# EAGLE design PidiPad (EAGLE 9.2.0)
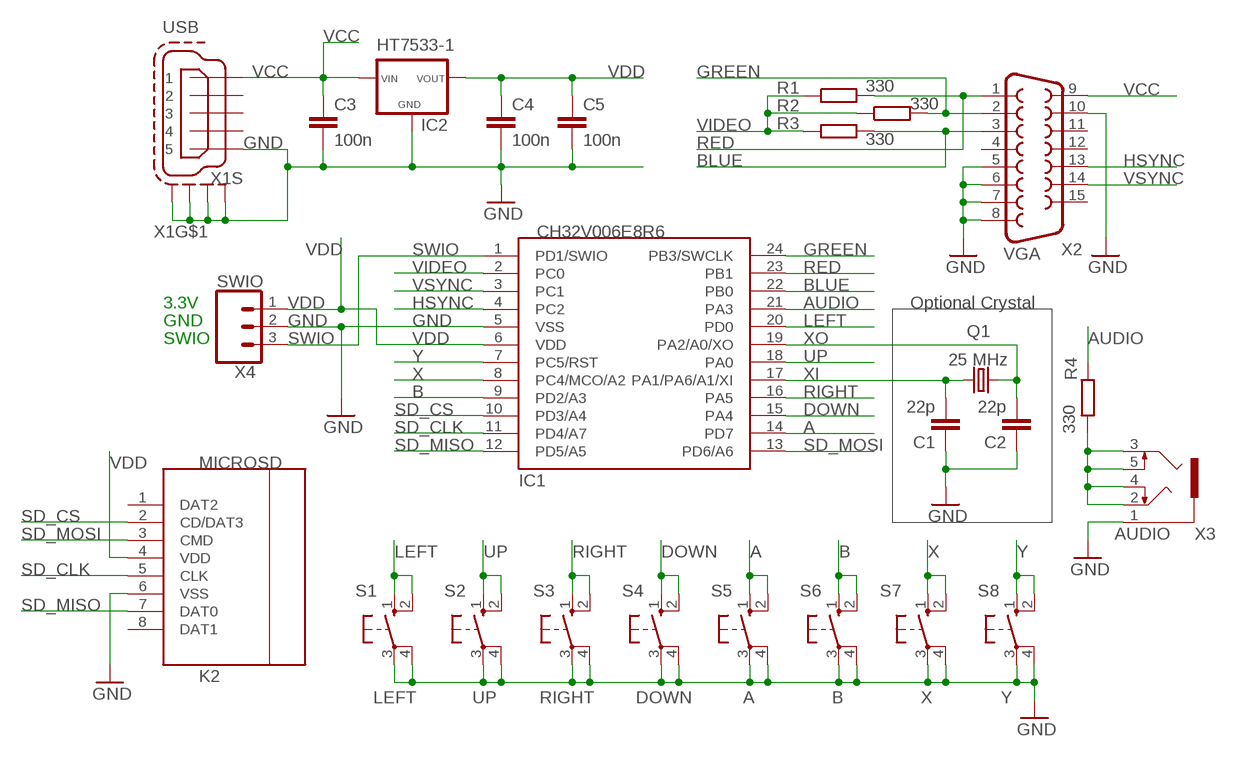
[diagram p0: schematic, sheet 1]

## Parts
C1  22p  C-EU050-024X044  [C050-024X044]
C2  22p  C-EU050-024X044  [C050-024X044]
C3  100n  C-EU050-024X044  [C050-024X044]
C4  100n  C-EU050-024X044  [C050-024X044]
C5  100n  C-EU050-024X044  [C050-024X044]
IC1  CH32V006E8R6  [QSOP24]
IC2  HT7533-1  [HT7533-1]
K2  MICROSD  [MICROSD]
Q1  25 MHz  CRYSTALHC49U-V  [HC49U-V]
R1  330  R-EU_0204/7  [0204/7]
R2  330  R-EU_0204/7  [0204/7]
R3  330  R-EU_0204/7  [0204/7]
R4  330  R-EU_0204/7  [0204/7]
S1  LEFT  10-XX  [B3F-10XX]
S2  UP  10-XX  [B3F-10XX]
S3  RIGHT  10-XX  [B3F-10XX]
S4  DOWN  10-XX  [B3F-10XX]
S5  A  10-XX  [B3F-10XX]
S6  B  10-XX  [B3F-10XX]
S7  X  10-XX  [B3F-10XX]
S8  Y  10-XX  [B3F-10XX]
X1  USB  MINI-USB-SCHIELD-32005-201  [32005-201]
X2  VGA  F15HDH  [HDF15H]
X3  AUDIO  1503_09  [1503_09]
X4  SWIO  CONN_03  [1X03]

## Nets
A: IC1.14(PD7) S5.1(S) S5.2(S1)
AUDIO: IC1.21(PA3) R4.2
B: IC1.9(PD2/A3) S6.1(S) S6.2(S1)
BLUE: IC1.22(PB0) R3.2 X2.3
DOWN: IC1.15(PA4) S4.1(S) S4.2(S1)
GND: C1.1 C2.1 C3.2 C4.2 C5.2 IC1.5(VSS) IC2.GND K2.6(VSS) S1.3(P) S1.4(P1) S2.3(P) S2.4(P1) S3.3(P) S3.4(P1) S4.3(P) S4.4(P1) S5.3(P) S5.4(P1) S6.3(P) S6.4(P1) S7.3(P) S7.4(P1) S8.3(P) S8.4(P1) X1.5 X1.M1(S:S1) X1.M2(S:S2) X1.M3(S:S3) X1.M4(S:S4) X2.5 X2.6 X2.7 X2.8 X2.10 X3.1 X4.2
GREEN: IC1.24(PB3/SWCLK) R2.2 X2.2
HSYNC: IC1.4(PC2) X2.13
LEFT: IC1.20(PD0) S1.1(S) S1.2(S1)
N$7: R4.1 X3.2 X3.3 X3.4 X3.5
RED: IC1.23(PB1) R1.2 X2.1
RIGHT: IC1.16(PA5) S3.1(S) S3.2(S1)
SD_CLK: IC1.11(PD4/A7) K2.5(CLK)
SD_CS: IC1.10(PD3/A4) K2.2(CD/DAT3)
SD_MISO: IC1.12(PD5/A5) K2.7(DAT0)
SD_MOSI: IC1.13(PD6/A6) K2.3(CMD)
SWIO: IC1.1(PD1/SWIO) X4.3
UP: IC1.18(PA0) S2.1(S) S2.2(S1)
VCC: C3.1 IC2.VIN X1.1 X2.9
VDD: C4.1 C5.1 IC1.6(VDD) IC2.VOUT K2.4(VDD) X4.1
VIDEO: IC1.2(PC0) R1.1 R2.1 R3.1
VSYNC: IC1.3(PC1) X2.14
X: IC1.8(PC4/MCO/A2) S7.1(S) S7.2(S1)
XI: C1.2 IC1.17(PA1/PA6/A1/XI) Q1.2
XO: C2.2 IC1.19(PA2/A0/XO) Q1.1
Y: IC1.7(PC5/RST) S8.1(S) S8.2(S1)
Unconnected: K2.1(DAT2) K2.8(DAT1) X1.2 X1.3 X1.4 X2.4 X2.11 X2.12 X2.15

## Notes on the sheet
- 3.3V | Optional Crystal
- GND
- SWIO

## Library data of the parts
C1-C5 = rcl:C-EU: CAPACITOR, European symbol; SPICEPREFIX: C
IC1 = CH32V:CH32V006E8R6
IC2 = HT7533-1B:HT7533-1
K2 = Wuerth_Elektronik_eiCan_Communication_Connectors_v2.2:MICROSD: WR-CRD MICRO SD CARD CONNECTOR HINGE 8PINS
Q1 = crystal:CRYSTAL: CRYSTAL; OC_FARNELL: 1666969; OC_NEWARK: unknown
R1-R4 = rcl:R-EU_: RESISTOR, European symbol; SPICEPREFIX: R
S1-S8 = switch-omron:10-XX: OMRON SWITCH; MPN: B3F-1000; OC_FARNELL: 176432; OC_NEWARK: 36M3542
X1 = con-cypressindustries:MINI-USB-SCHIELD-: MINI USB-B Conector Source: www.cypressindustries.com; OC_FARNELL: unknown; OC_NEWARK: unknown
X2 = adafruit_B:F15: SUB-D HDH is also known as a 'right angle VGA' connector
X3 = con-lumberg:1503_09: Jack connectors according to JISC 6560, 3.5 mm Klinkeneinbaukupplung nach JISC 6560, 3,5 mm, 3-polig/ stereo, abgewinkelte Ausführung, mit 2 Öffnern und Lötaugen, für Leiterplatten Rückseitenmontage Source: http://www.lumberg.com/Produkte/PDFs/1503_09.pdf; OC_FARNELL: 1243244; OC_NEWARK: unknown
X4 = SparkFun-Connectors:CONN_03: Multi connection point. Often used as Generic Header-pin footprint for 0.1 inch spaced/style header connections On any of the 0.1 inch spaced packages, you can populate with these: Break Away Headers - Straight <https://www.sparkfun.com/products/116> (PRT-00116) Break Away Male Headers - Right Angle <https://www.sparkfun.com/products/553> (PRT-00553) Female Headers <https://www.sparkfun.com/products/115> (PRT-00115) Break Away Headers - Machine Pin <https://www.sparkfun.com/products/117> (PRT-00117) Break Away Female Headers - Swiss Machine Pin <https://www.sparkfun.com/products/743> (PRT-00743) Stackable Header - 3 Pin (Female, 0.1") <https://www.sparkfun.com/products/13875> (PRT-13875) For SCREWTERMINALS and SPRING TERMINALS visit here: Screw Terimnals on SparkFun.com <https://www.sparkfun.com/search/results?term=Screw+Terminals> (5mm/3.5mm/2.54mm spacing) This device is also useful as a general connection point to wire up your design to another part of your project. Our various solder wires solder well into these plated through hole pads. Hook-Up Wire - Assortment (Stranded, 22 AWG) <https://www.sparkfun.com/products/11375> (PRT-11375) Hook-Up Wire - Assortment (Solid Core, 22 AWG) <https://www.sparkfun.com/products/11367> (PRT-11367) View the entire wire category on our website here <https://www.sparkfun.com/categories/141> Special notes: Molex polarized connector foot print use with SKU : PRT-08232 with associated crimp pins and housings.

## Board
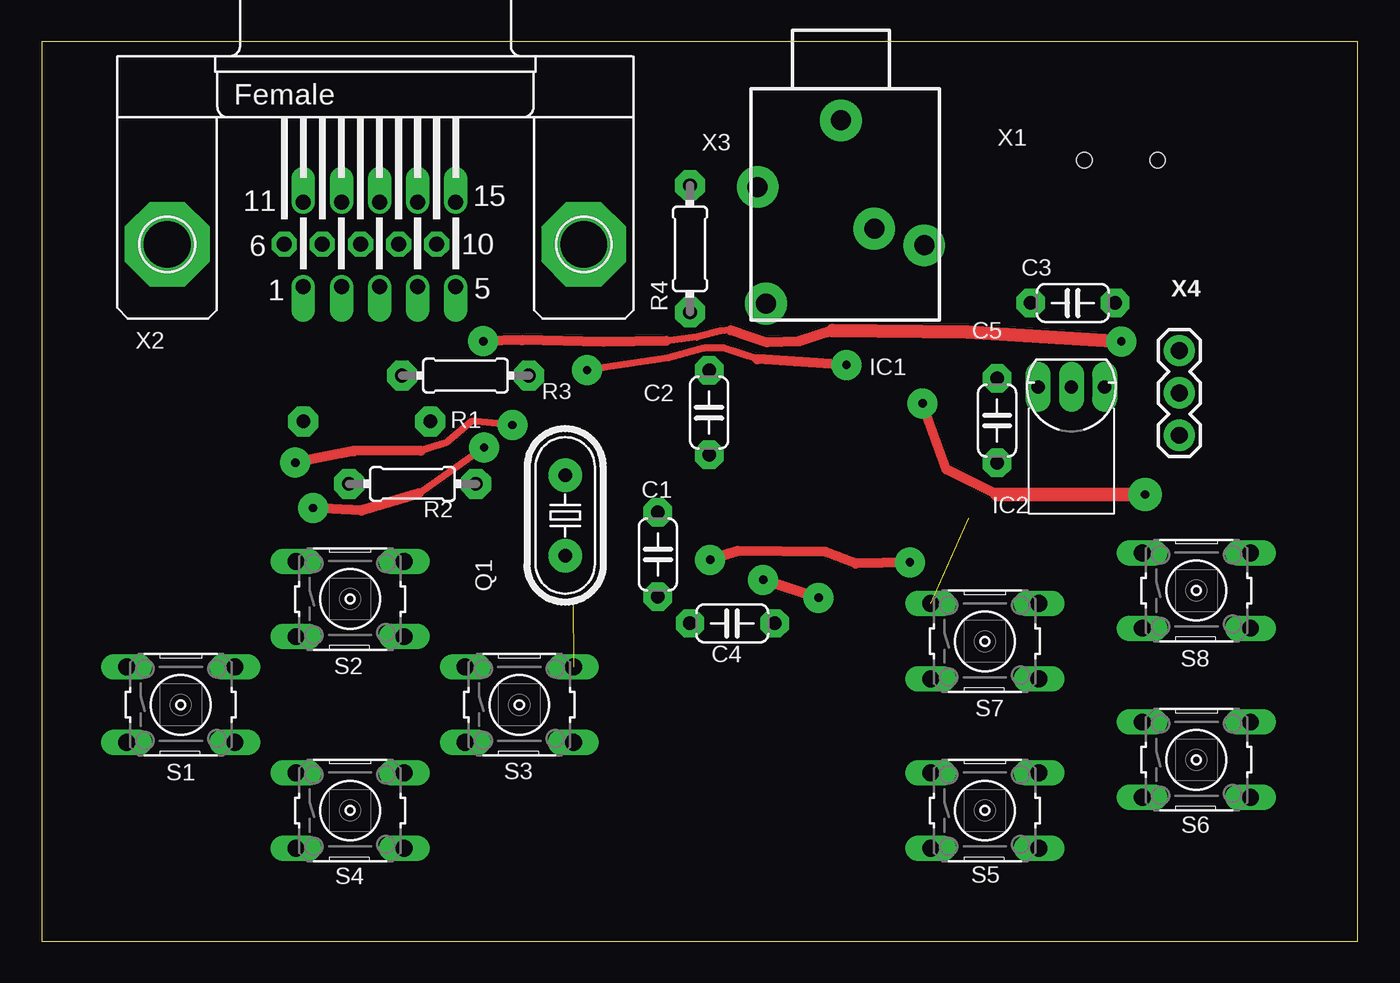
[diagram p1: board, top side]
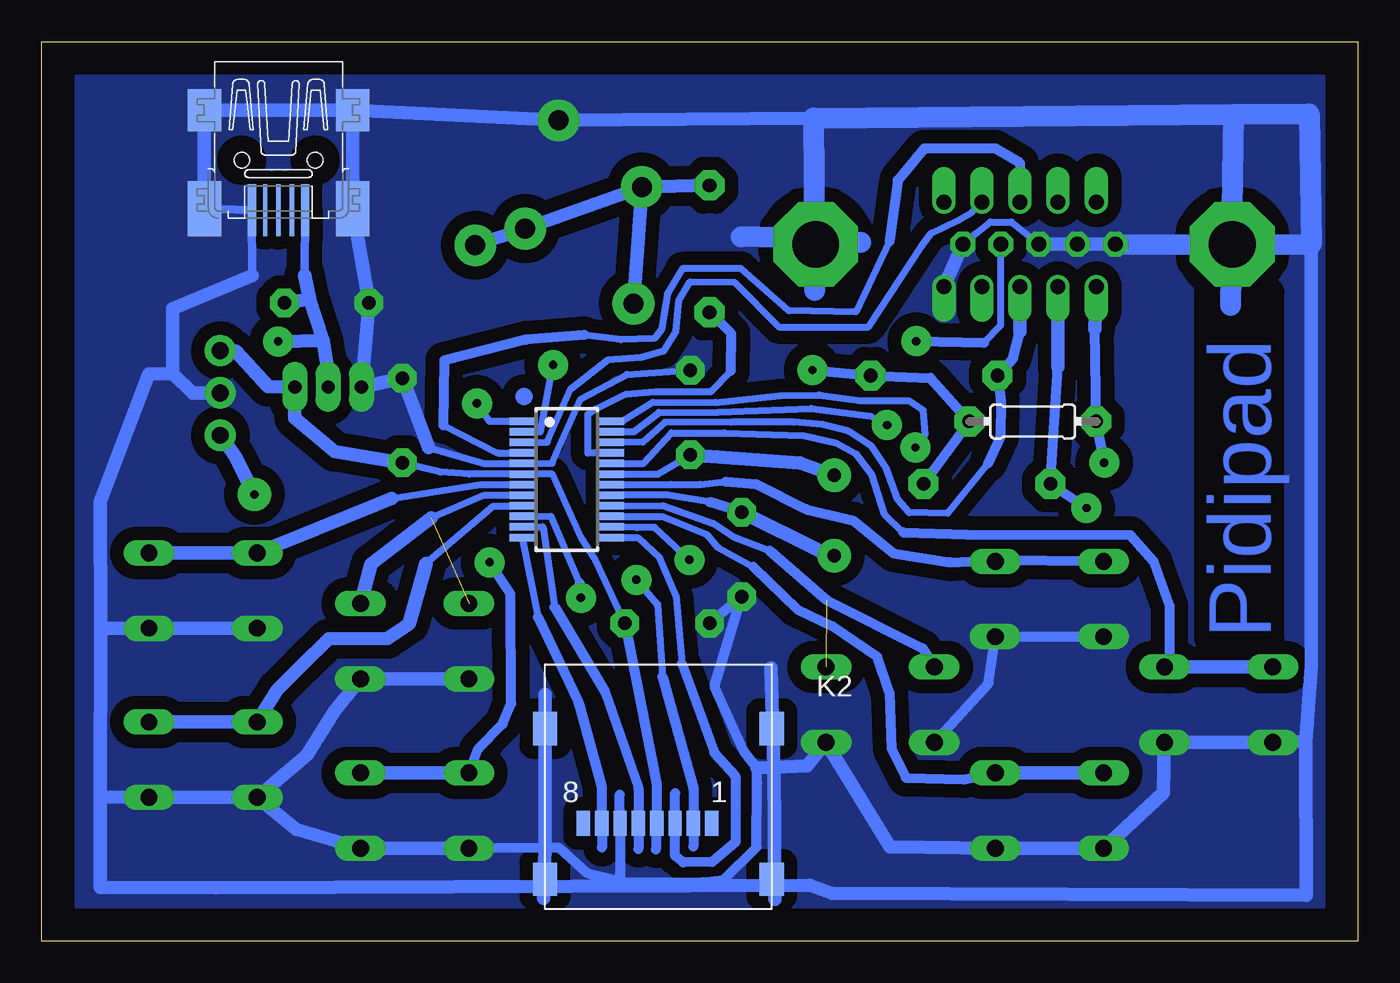
[diagram p2: board, bottom side, seen from below]

Size 79 x 54 mm. Coordinates in mm from the lower left corner, seen from the top.
Outline: 0,0 79,0 79,54 0,54 0,0
Copper layers (1*16): Top 0.035mm / dielectric 1.5mm / Bottom 0.035mm
Design rules "default": minimum track width 6mil, minimum drill 0.35mm, track to track 6mil, track to pad 6mil, pad to pad 6mil, via to via 6mil, smd to smd 6mil, copper to edge 40mil, drill to drill 6mil, minimum pad ring 10mil, minimum via ring 8mil, stop-mask expansion 4mil, vias tented up to drill 0mil, thermal gap 10mil

### Footprints (pad centres in the part's own frame; a part is rotated, then mirrored left to right if it is on the bottom)
C050-024X044 = drill 0.813 pad 1.7 octagon: 1 -2.54,0; 2 2.54,0
QSOP24 = smd 0.45 x 1.5: 1 -3.493,-2.69; 2 -2.857,-2.69; 3 -2.223,-2.69; 4 -1.587,-2.69; 5 -0.953,-2.69; 6 -0.318,-2.69; 7 0.318,-2.69; 8 0.953,-2.69; 9 1.587,-2.69; 10 2.223,-2.69; 11 2.857,-2.69; 12 3.493,-2.69; 13 3.493,2.69; 14 2.857,2.69; 15 2.223,2.69; 16 1.587,2.69; 17 0.953,2.69; 18 0.318,2.69; 19 -0.318,2.69; 20 -0.953,2.69; 21 -1.587,2.69; 22 -2.223,2.69; 23 -2.857,2.69; 24 -3.493,2.69
HT7533-1 = drill 0.8 pad 1.5 long: GND 2,0; VIN 0,0; VOUT -2,0
MICROSD = smd 0.8 x 1.5: 1 2.62,-2.54; 2 1.52,-2.54; 3 0.42,-2.54; 4 -0.68,-2.54; 5 -1.78,-2.54; 6 -2.88,-2.54; 7 -3.98,-2.54; 8 -5.08,-2.54 | smd 1.45 x 2: Z1 -7.38,3.16; Z2 6.22,3.16; Z3 -7.38,-5.89; Z4 6.22,-5.89
HC49U-V = drill 0.813 pad 2: 1 -2.413,0; 2 2.413,0
0204/7 = drill 0.813 pad 1.8 octagon: 1 -3.81,0; 2 3.81,0
B3F-10XX = drill 1.016 long: 1 -3.251,2.261; 2 3.251,2.261; 3 -3.251,-2.261; 4 3.251,-2.261
32005-201 = smd 3.1 x 0.5: 1 3,1.6; 5 3,-1.6 | smd 3.1 x 0.254: 2 3,0.8; 3 3,0; 4 3,-0.8 | smd 2.5 x 2: M1 -3,-4.45; M2 -3,4.45 | smd 3.3 x 2: M3 2.9,4.45; M4 2.9,-4.45 | hole 0.9: 0,2.2; 0,-2.2
HDF15H = drill 0.9 pad 1.27 offset: 1 4.329,2.54; 2 2.043,2.54; 3 -0.243,2.54; 4 -2.529,2.54; 5 -4.815,2.54; 11 4.329,-2.54; 12 2.043,-2.54; 13 -0.243,-2.54; 14 -2.529,-2.54; 15 -4.815,-2.54 | drill 0.9 pad 1.5 octagon: 6 5.472,0; 7 3.186,0; 8 0.9,0; 9 -1.386,0; 10 -3.672,0 | drill 2.8 pad 5.08 octagon: P$1 -12.5,0; P$2 12.5,0
1503_09 = drill 1.2 pad 2.5: 1 0,-2; 2 -5,-6; 3 5,-9.5; 4 -4.5,-13; 5 2,-8.5
1X03 = drill 1.016 pad 1.88: 1 0,0; 2 2.54,0; 3 5.08,0

### Placement (x,y rotation side)
C1  36.98,23.21 90 top
C2  40.06,31.73 270 top
C3  61.9,38.31 180 top
C4  41.45,19.08 180 top
C5  57.35,31.25 90 top
IC1  47.47,27.72 270 bottom
IC2  61.81,33.27 180 top
K2  41.4,9.61 0 bottom
Q1  31.42,25.56 270 top
R1  19.51,31.2 0 bottom
R2  22.26,27.45 180 top
R3  25.44,33.96 180 top
R4  38.91,41.56 270 top
S1  8.35,14.19 0 top
S2  18.51,20.54 0 top
S3  28.67,14.19 0 top
S4  18.51,7.84 0 top
S5  56.61,7.84 0 top
S6  69.31,10.89 0 top
S7  56.61,18 0 top
S8  69.31,21.05 0 top
X1  64.79,46.89 270 bottom
X2  20.04,41.83 180 top
X3  47.97,51.28 0 top
X4  68.28,35.45 270 top

### Tracks (layer width: path | path; a pad name or v marks a point on that pad's centre or on a via)
A  (via drill 0.5 pad 1.8)
  Top 0.61: v52.12,22.74 48.87,22.67 47.03,23.38 41.78,23.42 v40.12,22.9
  Bottom 0.406: v40.12,22.9 42.2,24.85 43.28,24.83 IC1.14
  Bottom 0.61: S5.1 52.8,11.54 51.33,13.03 50.81,14.25 50.87,20.84 v52.12,22.74
  Bottom 0.813: S5.2 S5.1
AUDIO
  Bottom 0.406: IC1.21 46.22,29.29 46.21,31.64 45.7,31.97 43.94,32.84 42.18,32.99 38.83,32.99 37.63,34.23
  Bottom 0.61: 37.63,34.23 37.61,36.47 R4.2
B
  Bottom 0.406: 55.91,22.67 51.87,26.12 IC1.9
  Bottom 0.813: S6.2 S6.1 64.85,15.08 63.41,16.53 61.78,18.13 58.25,18.17 56.94,19.05 55.91,22.67
BLUE
  Bottom 0.406: 22.19,28.68 24.63,25.69 26.93,25.73 27.6,26.48 28.29,28.37 29.2,29.73 30.58,30.62 32.13,31.02 33.85,31.16 37.61,31.15 41.59,31.14 42.91,29.95 IC1.22
  Bottom 0.61: 20.28,36.61 20.7,34.98 R3.2 21.43,32.42 21.46,30.3 22.19,28.68
  Bottom 0.813: 20.28,36.61 X2.3
DOWN
  Bottom 0.406: IC1.15 41.77,25.49 39.03,24.38 38.39,23.64 36.27,22.48
  Bottom 0.61: 36.27,22.48 33.64,19.91 31.51,18.89 28.86,17.09 28.11,14.88 28,11.55 27.13,9.82 23.65,9.71 S4.2
  Bottom 0.813: S4.2 S4.1
GND
  Bottom 0.406: 55.79,29.62 52.42,28.67 IC1.5 48.36,28.69 46.65,32.53 43.87,34.02 C2.1 | X2.10 22.06,43.17 20.79,43.18 X2.8
  Bottom 0.508: 66.37,39.95 X1.5 X1.M4
  Bottom 0.61: 44.29,3.57 44.3,4.03 K2.6 44.31,8.79 | 44.29,3.57 45.21,3.8 46.2,4.05 47.92,5.6 48.79,5.6 S5.3 | 44.29,3.57 39.33,3.54 38.09,3.68 36.09,5.65 36.06,9.51 36.07,10.4 36.86,11.4 38.6,15.29 C1.1 C4.2 | S3.3 22.17,15.48 S2.4 S2.3
  Bottom 0.813: X1.M2 X3.1 32.66,49.41 | X1.M2 X1.M1 X1.M4 | X1.M2 X1.M3 C3.2 IC2.GND C5.2 55.79,29.62 | 66.37,39.95 71.14,37.97 71.15,34.07 | 71.15,34.07 69.93,32.91 X4.2 | S8.3 S8.4 75.47,18.79 | S6.3 S6.4 75.49,8.66 | S7.3 S7.4 61.41,13.82 63.08,11.17 S6.3 | S5.3 S5.4 63.72,6.7 S6.3 | 75.49,8.66 75.47,18.79 | 75.47,18.79 75.48,26.4 72.58,34.06 71.15,34.07 | X2.5 X2.10 | X2.8 X2.7 X2.6 | 36.07,10.4 35.03,10.45 | 35.03,10.45 33.07,10.54 S3.4 28.09,5.66 S4.4 S4.3 11.66,8.89 S1.4 S1.3 3.13,12 | 2.81,41.82 2.8,16.45 3.13,12 | 35.03,10.45 35.23,16.4 | 35.03,10.45 35,2.53 | 48.86,2.56 48.79,5.6 48.79,14.81 | 3.13,12 3.08,2.76 31.58,2.87 32.88,3.36 68.54,3.19 75.49,3.25 75.49,8.66
  Bottom 1.27: X2.6 2.81,41.82 2.92,49.67 7.48,49.63 | 7.48,49.63 32.66,49.41 32.62,42.18 | 32.62,42.18 32.61,39.08 | 7.48,49.63 7.64,38.16 | 32.62,42.18 37.01,42.29 | 32.62,42.18 29.85,41.96
  pour Bottom (isolate 0.813, no thermals): 2,2 2,52 77,52 77,2
GREEN  (via drill 0.5 pad 1.8)
  Top 0.406: v26.55,29.63 22.64,26.88
  Top 0.61: 22.64,26.88 19.19,25.85 v16.29,26.01
  Bottom 0.406: IC1.24 44.13,31.22 42.32,32.36 38.55,32.35 34.67,32.75 32.34,32.78 29.86,32.45 26.96,32.45 26.09,31.88 25.97,30.41 26.59,29.58 v26.55,29.63
  Bottom 0.61: 18.01,34.45 R2.2 v16.29,26.01
  Bottom 0.813: 18.01,34.45 X2.2
HSYNC
  Bottom 0.406: 28.11,42.02 30.13,37.78 34.17,37.84 37.03,40.38 40.54,40.36 41.44,38.87 41.78,36.74 42.22,36.18 44.25,36.11 46.44,36.4 | 54.89,30.98 51.63,29.31 IC1.4
  Bottom 0.61: X2.13 20.27,46.7 21.74,47.58 26.03,47.59 27.62,45.69 28.11,42.02 | 46.44,36.4 49.92,36.11 54.84,34.85 54.89,30.98
LEFT
  Bottom 0.406: IC1.20 42.86,28.68 41.21,30.52 38.04,30.51 33.27,30.35 31.3,29.9 30.15,29.27 29.18,28.03 28.44,25.65 27.3,24.54 | 11.3,15.98 S1.2
  Bottom 0.61: 27.3,24.54 23.45,24.41 13.64,24.38 12.28,22.83 11.3,20.13 11.3,15.98
  Bottom 0.813: S1.2 S1.1
N$7
  Bottom 0.813: X3.3 X3.5 X3.2 | X3.2 R4.1 | X3.2 X3.4
RED  (via drill 0.5 pad 1.8)
  Top 0.406: v28.25,30.99 25.81,31.21 24.23,29.91 22.77,29.44
  Top 0.61: 22.77,29.44 18.73,29.42 v15.23,28.73
  Bottom 0.406: IC1.23 43.45,30.59 41.95,31.74 38.4,31.76 32.8,31.98 29.25,31.52 v28.25,30.99
  Bottom 0.61: 15.77,36.74 R1.2 v15.23,28.73
  Bottom 0.813: 15.77,36.74 X2.1
RIGHT  (1 unrouted)
  Bottom 0.406: IC1.16 41.7,26.14 38.68,25.08 37.46,24.25 35.3,23.45
  Bottom 0.61: 35.3,23.45 31.9,20.49 26.11,17.58 S3.1
SD_CLK
  Bottom 0.406: IC1.11 48.91,24.87 48.22,20.06
  Bottom 0.61: 48.22,20.06 45.2,14.97 43.18,9.19 K2.5 43.18,5.54
SD_CS  (via drill 0.5 pad 1.8)
  Top 0.61: v46.63,20.61 v43.31,21.7
  Bottom 0.406: IC1.10 48.44,25.51 46.7,21.5 | 41.75,15.87 42.03,20.22 v43.31,21.7
  Bottom 0.61: 41.75,15.87 39.89,9.17 K2.2 39.88,5.69 | 46.7,21.5 v46.63,20.61
SD_MISO
  Bottom 0.406: IC1.12 49.21,19.44
  Bottom 0.61: 49.21,19.44 46.78,14.32 45.39,9.29 K2.7 45.38,5.61
SD_MOSI
  Bottom 0.406: IC1.13 43.22,24.23 41.91,23.02 40.93,20.74 40.58,16.66
  Bottom 0.61: 40.58,16.66 38.62,11.32 37.36,9.91 37.37,5.92 38.74,4.76 40.48,4.72 40.98,5.12 K2.3 40.98,8.9
SWIO  (via drill 0.5 pad 1.8, 0.5 pad 2)
  Top 0.61: 57.33,26.83 54.3,28.33 v52.87,32.28
  Top 0.813: v66.24,26.82 57.33,26.83
  Bottom 0.406: v52.87,32.28 52.14,31.22 IC1.1
  Bottom 0.813: X4.3 67.37,29.07 v66.24,26.82
UP
  Bottom 0.406: IC1.18 41.22,27.42 39.45,27.42 37.93,27.58 | 22.08,22.85 S2.2
  Bottom 0.61: 37.93,27.58 36.11,27.43 33.09,25.92 30.29,25.25 27.85,23.29 24.46,22.74 22.08,22.85 S2.1
VCC  (via drill 0.5 pad 1.8)
  Top 0.406: 41.35,36.67 40.7,36.63 39.31,36.26 37.49,36.03
  Top 0.61: 47.46,36.66 45.43,36 43.54,35.95 41.35,36.67 | 37.49,36.03 33.71,35.98 28.86,36.08 v26.51,36.01
  Top 0.813: v64.81,36.01 55.57,36.58 47.46,36.66
  Bottom 0.406: 22.44,35.92 21.43,36.98 X2.9
  Bottom 0.508: X1.1 63.2,39.98
  Bottom 0.61: v26.51,36.01 22.44,35.92
  Bottom 0.813: IC2.VIN 61.91,34.72 62.1,36.04 | 62.1,36.04 62.92,38.55 | 62.92,38.55 63.2,39.98 | C3.1 62.92,38.55 | 62.1,36.04 v64.81,36.01
VDD
  Bottom 0.406: C4.1 45.76,22.88 46.62,24.23 48.34,28.05 IC1.6 53.34,28.03 55.06,28.16 C5.1
  Bottom 0.61: C4.1 42.08,9.43 K2.4 42.13,5.5
  Bottom 0.813: X4.1 67.36,35.43 65.4,33.29 IC2.VOUT 63.82,31.42 61.41,29.39 C5.1
VIDEO  (via drill 0.5 pad 1.8)
  Top 0.406: 42.96,34.94 40.91,35.62 39.77,35.6 37.58,35.01 v32.73,34.28
  Top 0.61: v48.3,34.59 42.96,34.94
  Bottom 0.406: IC1.2 49.07,30.58 v48.3,34.59
  Bottom 0.61: v32.73,34.28 R3.1 25.65,33.81 R1.1 R2.1
VSYNC
  Bottom 0.406: IC1.3 48.65,29.95 47.25,33.16 45,34.91 43,35.05 41.65,35.45 40.93,36.58 40.74,38.49 40.07,39.59 37.42,39.56 34.75,36.87 29.38,36.87 26.16,41.75 25.59,42.52 23.98,43.28 23.19,43.74 X2.14
X  (1 unrouted)
  Bottom 0.406: 55.64,25.41 52.41,26.77 IC1.8
  Bottom 0.813: S7.2 59.23,22.66 55.64,25.41
XI
  Bottom 0.406: 38.91,26.36 41.46,26.79 IC1.17 | 32.22,23.39 Q1.2
  Bottom 0.61: C1.2 38.91,26.36
  Bottom 0.813: C1.2 32.22,23.39
XO
  Bottom 0.406: IC1.19 41.99,28.03 C2.2
  Bottom 0.813: C2.2 33.48,28.69 Q1.1
Y
  Bottom 0.406: 58,26.57 52.68,27.4 IC1.7
  Bottom 0.813: S8.2 S8.1 63.46,24.35 58,26.57
(copper drawn outside any net)
  shapes: Bottom circle x1

### Text on the board
Bottom: Pidipad
Document: +3.3V | GND | SWIO